# EAGLE design EspRelay (EAGLE 8.6.0)
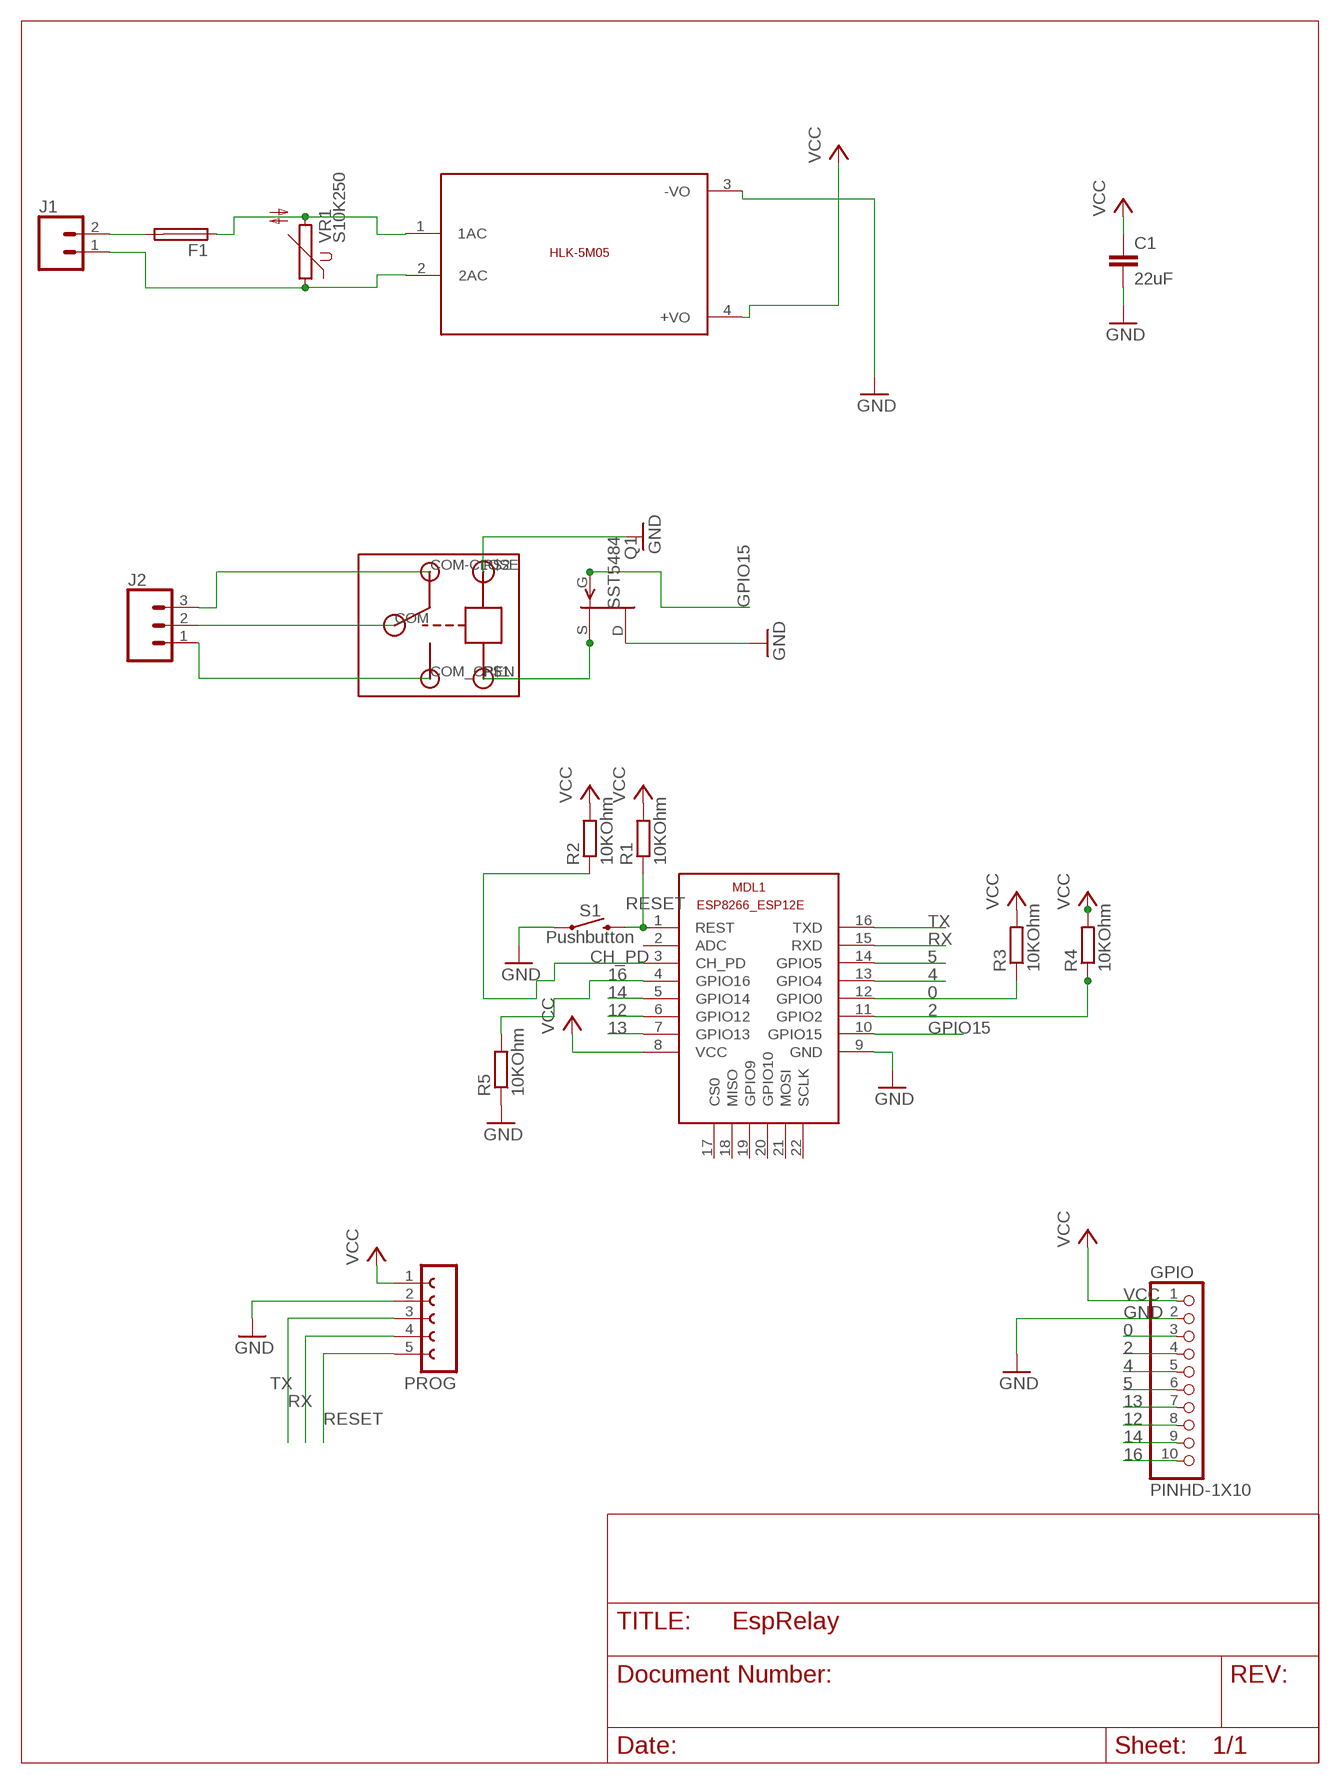
[diagram p0: schematic, sheet 1]

## Parts
C1  22uF  2.2UF-CERCAP-07888  [0402-CAP]
F1  PICOFUSE  [PICOFUSE]
GPIO  PINHD-1X10  [1X10-BIG]
J1  CONN_025MM  [SCREWTERMINAL-5MM-2]
J2  CONN_03-SCREW-5MM  [SCREWTERMINAL-5MM-3]
MDL1  ESP8266-12EESP8266-ESP12E  [ESP8266-ESP12E]
PROG  FE05-1  [FE05-1]
Q1  SST5484  [SOT23]
R1  10KOhm  R-EU_R0805  [R0805]
R2  10KOhm  R-EU_R0805  [R0805]
R3  10KOhm  R-EU_R0805  [R0805]
R4  10KOhm  R-EU_R0805  [R0805]
R5  10KOhm  R-EU_R0805  [R0805]
S1  Pushbutton  MOMENTARY-SWITCH-SPST-SMD-6.0X3.5MM  [TACTILE_SWITCH_SMD_6.0X3.5MM]
U$1  RELAY  [RELAY]
U$2  5VDC/5W  HLK-5M05  [HLK-5M05]
VR1  S10K250  [S10K250]

## Nets
0: GPIO.3 MDL1.12(GPIO0) R3.1
2: GPIO.4 MDL1.11(GPIO2) R4.1
4: GPIO.5 MDL1.13(GPIO4)
5: GPIO.6 MDL1.14(GPIO5)
12: GPIO.8 MDL1.6(GPIO12)
13: GPIO.7 MDL1.7(GPIO13)
14: GPIO.9 MDL1.5(GPIO14)
16: GPIO.10 MDL1.4(GPIO16) R5.2
CH_PD: MDL1.3(CH_PD) R2.1
GND: C1.2 GPIO.2 MDL1.9(GND) PROG.2 Q1.1(D) R5.1 S1.1 U$1.P$2(GND) U$2.3(-VO)
GPIO15: MDL1.10(GPIO15) Q1.3(G)
N$1: Q1.2(S) U$1.P$1(IN)
N$2: J2.1 U$1.COM_CPEN(COM-OPEN)
N$3: J2.2 U$1.COM
N$5: J2.3 U$1.COM-CLOSE
N$6: F1.2 J1.2
N$7: J1.1 U$2.2(2AC) VR1.1
N$8: F1.1 U$2.1(1AC) VR1.2
RESET: MDL1.1(REST) PROG.5 R1.1 S1.2
RX: MDL1.15(RXD) PROG.4
TX: MDL1.16(TXD) PROG.3
VCC: C1.1 GPIO.1 MDL1.8(VCC) PROG.1 R1.2 R2.2 R3.2 R4.2 U$2.4(+VO)
Unconnected: MDL1.2(ADC) MDL1.17(CS0) MDL1.18(MISO) MDL1.19(GPIO9) MDL1.20(GPIO10) MDL1.21(MOSI) MDL1.22(SCLK)

## Library data of the parts
C1 = SparkFun-Retired:2.2UF-CER: 2.2uF Ceramic SMT CAP-07888- 10V, 20% (0603) CAP-10009- 50V, 10% (1206); PROD_ID: CAP-07888; VALUE: 2.2uF
F1 = fuse:PICOFUSE: PICOFUSE 19275, Wickmann; OC_FARNELL: unknown; OC_NEWARK: unknown
GPIO = adafruit:PINHD-1X10: Pin header 1x10 0.1" spacing With round pins
J1 = SparkFun-Connectors:CONN_02: Multi connection point. Often used as Generic Header-pin footprint for 0.1 inch spaced/style header connections On any of the 0.1 inch spaced packages, you can populate with these: Break Away Headers - Straight <https://www.sparkfun.com/products/116> (PRT-00116) Break Away Male Headers - Right Angle <https://www.sparkfun.com/products/553> (PRT-00553) Female Headers <https://www.sparkfun.com/products/115> (PRT-00115) Break Away Headers - Machine Pin <https://www.sparkfun.com/products/117> (PRT-00117) Break Away Female Headers - Swiss Machine Pin <https://www.sparkfun.com/products/743> (PRT-00743) For SCREWTERMINALS and SPRING TERMINALS visit here: Screw Terimnals on SparkFun.com <https://www.sparkfun.com/search/results?term=Screw+Terminals> (5mm/3.5mm/2.54mm spacing) This device is also useful as a general connection point to wire up your design to another part of your project. Our various solder wires solder well into these plated through hole pads. Hook-Up Wire - Assortment (Stranded, 22 AWG) <https://www.sparkfun.com/products/11375> (PRT-11375) Hook-Up Wire - Assortment (Solid Core, 22 AWG) <https://www.sparkfun.com/products/11367> (PRT-11367) View the entire wire category on our website here <https://www.sparkfun.com/categories/141> Special notes: Molex polarized connector foot print use with: PRT-08233 with associated crimp pins and housings. 2.54_SCREWTERM for use with PRT-10571. 3.5mm Screw Terminal footprints for PRT-08084 5mm Screw Terminal footprints for use with PRT-08432; SF_SKU: PRT-08432
J2 = SparkFun-Connectors:CONN_03: Multi connection point. Often used as Generic Header-pin footprint for 0.1 inch spaced/style header connections On any of the 0.1 inch spaced packages, you can populate with these: Break Away Headers - Straight <https://www.sparkfun.com/products/116> (PRT-00116) Break Away Male Headers - Right Angle <https://www.sparkfun.com/products/553> (PRT-00553) Female Headers <https://www.sparkfun.com/products/115> (PRT-00115) Break Away Headers - Machine Pin <https://www.sparkfun.com/products/117> (PRT-00117) Break Away Female Headers - Swiss Machine Pin <https://www.sparkfun.com/products/743> (PRT-00743) Stackable Header - 3 Pin (Female, 0.1") <https://www.sparkfun.com/products/13875> (PRT-13875) For SCREWTERMINALS and SPRING TERMINALS visit here: Screw Terimnals on SparkFun.com <https://www.sparkfun.com/search/results?term=Screw+Terminals> (5mm/3.5mm/2.54mm spacing) This device is also useful as a general connection point to wire up your design to another part of your project. Our various solder wires solder well into these plated through hole pads. Hook-Up Wire - Assortment (Stranded, 22 AWG) <https://www.sparkfun.com/products/11375> (PRT-11375) Hook-Up Wire - Assortment (Solid Core, 22 AWG) <https://www.sparkfun.com/products/11367> (PRT-11367) View the entire wire category on our website here <https://www.sparkfun.com/categories/141> Special notes: Molex polarized connector foot print use with SKU : PRT-08232 with associated crimp pins and housings.; PROD_ID: CONN-10134; SF_SKU: PRT-08433
MDL1 = ESP8266-ESP12E:ESP8266-12E: ESP8266-12E with additional I/O and GPIO04/05 corrected The author cannot warrant that this library is free from error or will meet your specific requirements. Created by PuceBaboon.com. Komagane, Nagano, JAPAN
PROG = con-lsta:FE05-1: FEMALE HEADER; OC_FARNELL: unknown; OC_NEWARK: unknown
Q1 = transistor-fet:?548*: N-Channel JFETs Source: VISHAY 2N5484.pdf Compatible: TO92 2N5245 J304 J305 U310 J308 J309 J310 TO72 2N4416 2N4416A 2N3823 2N4351 3N169 3N170 3N171 MFE3002 TO18 2N3796 2N3797 MFE825 Source: Motorola European Master Guide Pacge 3-59
R1-R5 = rcl:R-EU_: RESISTOR, European symbol; SPICEPREFIX: R
S1 = SparkFun-Switches:MOMENTARY-SWITCH-SPST: Momentary Switch (Pushbutton) - SPST Normally-open (NO) SPST momentary switches (buttons, pushbuttons). Variants PTH-12MM - 12mm square, through-hole Momentary Pushbutton Switch - 12mm Square <https://www.sparkfun.com/products/9190> (COM-09190) PTH-6.0MM, PTH-6.0MM-KIT - 6.0mm square, through-hole Mini Pushbutton Switch <https://www.sparkfun.com/products/97> (COM-00097) KIT package intended for soldering kit's - only one side of pads' copper is exposed. PTH-RIGHT-ANGLE-KIT - Right-angle, through-hole Right Angle Tactile Button <https://www.sparkfun.com/products/10791> - Used on SparkFun BigTime Watch Kit <https://www.sparkfun.com/products/11734> SMD-12MM - 12mm square, surface-mount Tactile Button - SMD (12mm) <https://www.sparkfun.com/products/12993> (COM-12993) Used on SparkFun PicoBoard <https://www.sparkfun.com/products/11888> SMD-4.5MM - 4.5mm Square Trackball Switch Used on SparkFun Blackberry Trackballer Breakout <https://www.sparkfun.com/products/13169> SMD-4.6MMX2.8MM - 4.60mm x 2.80mm, surface mount Used on SparkFun SAMD21 Mini Breakout <https://www.sparkfun.com/products/13664> SMD-5.2MM, SMD-5.2-REDUNDANT - 5.2mm square, surface-mount Mini Pushbutton Switch - SMD <https://www.sparkfun.com/products/8720> (COM-08720) Used on Arduino Pro Mini <https://www.sparkfun.com/products/11114> REDUNDANT package connects both switch circuits together SMD-6.0X3.5MM - 6.0 x 3.5mm, surface mount Momentary Reset Switch SMD <https://www.sparkfun.com/products/8229> (COM-08229) SMD-6.2MM-TALL - 6.2mm square, surface mount Tactile Button - SMD (6mm) <https://www.sparkfun.com/products/12992> Used on SparkFun Digital Sandbox <https://www.sparkfun.com/products/12651> SMD-RIGHT-ANGLE - Right-angle, surface mount Used on SparkFun Block for Intel® Edison - Arduino <https://www.sparkfun.com/products/13036>; PROD_ID: SWCH-00815; SF_SKU: COM-08229
U$1 = RELAY:RELAY
U$2 = HLK-5M05:HLK-5M05: HLK-5M05 is an 5Volt/5W smps developed by HI-LINK; SIZE: 23x38(mm)
VR1 = varistor:S10K250: VARISTOR

## Board
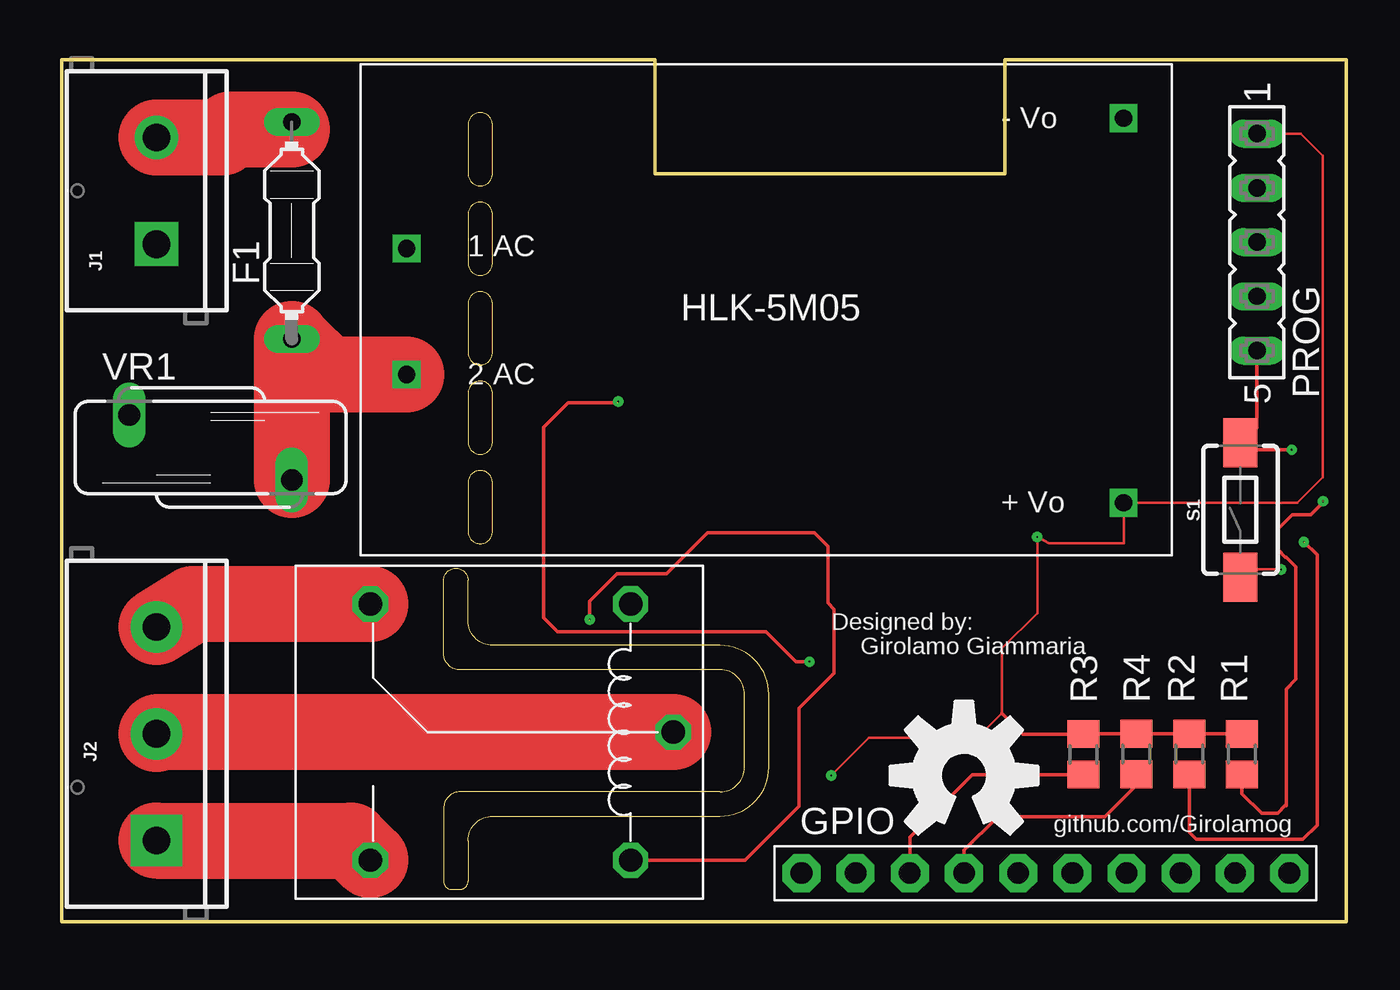
[diagram p1: board, top side]
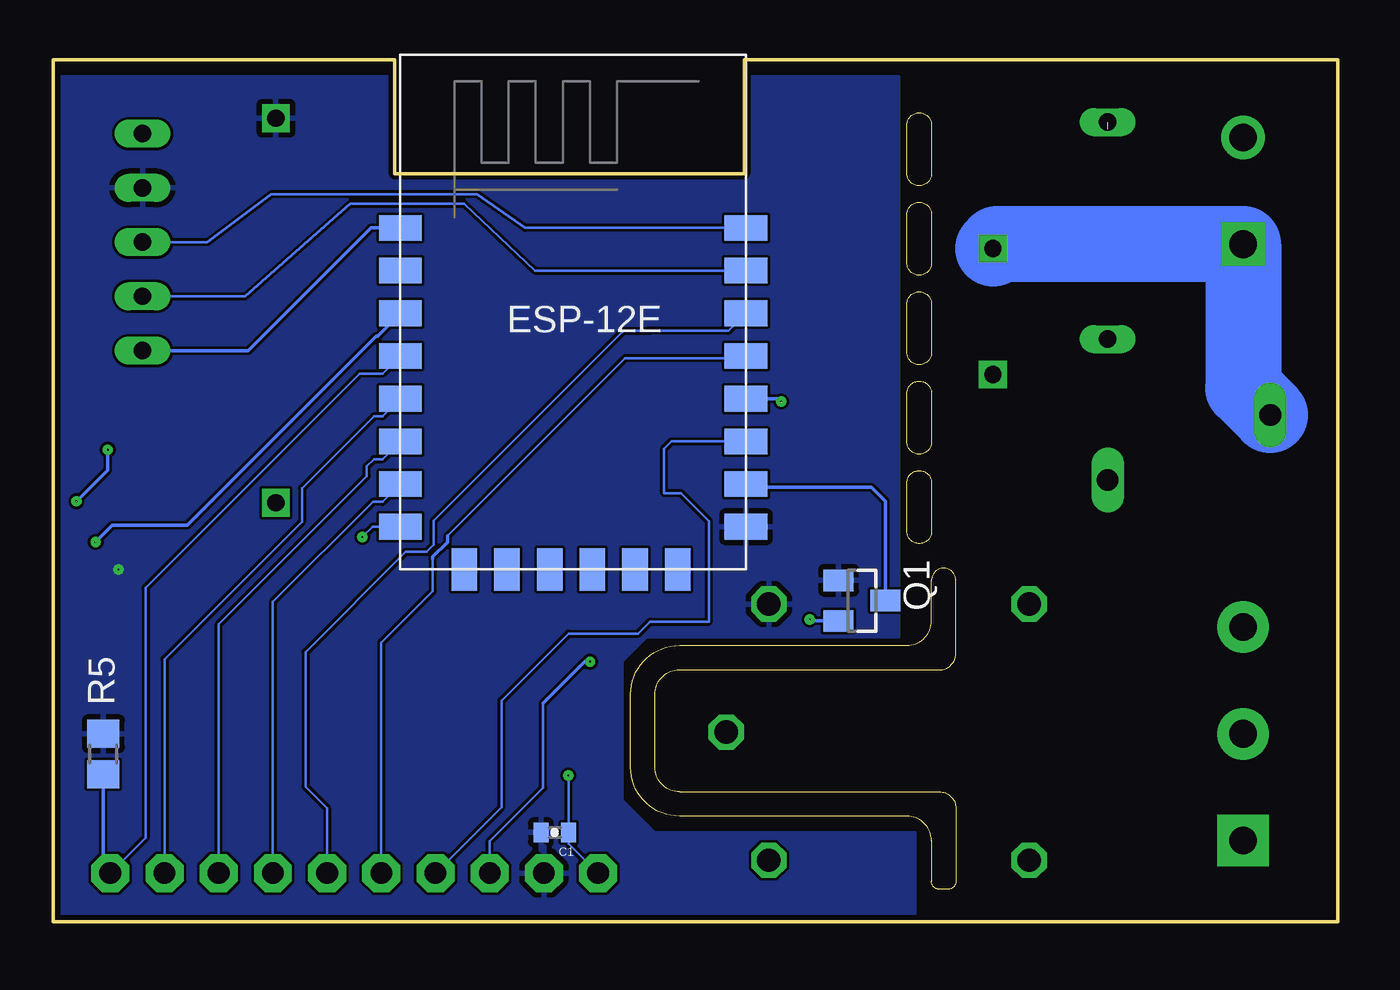
[diagram p2: board, bottom side, seen from below]

Size 60.2 x 40.39 mm. Coordinates in mm from the lower left corner, seen from the top.
Outline: 19.05,3.81 arc-90 20.19,4.95 30.86,4.95 arc90 33.15,7.24 33.15,10.67 arc90 30.86,12.95 20.19,12.95 arc-90 19.05,14.1 19.05,16 arc180 17.91,16 17.91,12.57 arc90 18.67,11.81 30.86,11.81 arc-90 32,10.67 32,7.24 arc-90 30.86,6.1 18.67,6.1 arc90 17.91,5.33 17.91,1.91 arc90 18.29,1.52 18.67,1.52 arc90 19.05,1.91 19.05,3.81
Outline: 19.05,20.57 19.05,18.29 arc180 20.19,18.29 20.19,20.57 arc180 19.05,20.57
Outline: 19.05,24.77 19.05,22.48 arc180 20.19,22.48 20.19,24.77 arc180 19.05,24.77
Outline: 19.05,28.96 19.05,26.67 arc180 20.19,26.67 20.19,28.96 arc180 19.05,28.96
Outline: 19.05,33.15 19.05,30.86 arc180 20.19,30.86 20.19,33.15 arc180 19.05,33.15
Outline: 19.05,37.34 19.05,35.05 arc180 20.19,35.05 20.19,37.34 arc180 19.05,37.34
Outline: 27.81,35.05 44.2,35.05 44.2,40.39 60.2,40.39 60.2,0 0,0 0,40.39 27.81,40.39 27.81,35.05
Copper layers (1*16): Top 0.035mm / dielectric 1.5mm / Bottom 0.035mm
Design rules "default *": minimum track width 3.5mil, minimum drill 0.2mm, track to track 5mil, track to pad 10mil, pad to pad 10mil, via to via 10mil, smd to smd 6mil, copper to edge 0.2mm, drill to drill 6mil, minimum pad ring 10mil, minimum via ring 8mil, stop-mask expansion 4mil, vias tented up to drill 0mil, thermal gap 10mil

### Footprints (pad centres in the part's own frame; a part is rotated, then mirrored left to right if it is on the bottom)
0402-CAP = smd 0.7 x 0.9: 1 -0.65,0; 2 0.65,0
PICOFUSE = drill 0.813 long: 1 -5.08,0; 2 5.08,0
1X10-BIG = drill 1.016 pad 1.778 octagon: 1 -11.43,0; 2 -8.89,0; 3 -6.35,0; 4 -3.81,0; 5 -1.27,0; 6 1.27,0; 7 3.81,0; 8 6.35,0; 9 8.89,0; 10 11.43,0
SCREWTERMINAL-5MM-2 = drill 1.3 pad 2.032 square: 1 0,0 | drill 1.3 pad 2.032: 2 5,0
SCREWTERMINAL-5MM-3 = drill 1.3 pad 2.413 square: 1 0,0 | drill 1.3 pad 2.413: 2 5,0; 3 10,0
ESP8266-ESP12E = smd 2 x 1.2: 1 0,16; 2 0,14; 3 0,12; 4 0,10; 5 0,8; 6 0,6; 7 0,4; 8 0,2; 9 16.2,2; 10 16.2,4; 11 16.2,6; 12 16.2,8; 13 16.2,10; 14 16.2,12; 15 16.2,14; 16 16.2,16 | smd 1.2 x 2: 17 11,0; 18 3,0; 19 5,0; 20 13,0; 21 7,0; 22 9,0
FE05-1 = drill 0.813 long: 1 -5.08,0; 2 -2.54,0; 3 0,0; 4 2.54,0; 5 5.08,0
SOT23 = smd 1 x 1.4: 1 -0.95,-1.1; 2 0.95,-1.1; 3 0,1.1
R0805 = smd 1.3 x 1.5: 1 -0.95,0; 2 0.95,0
TACTILE_SWITCH_SMD_6.0X3.5MM = smd 2.3 x 1.6: 1 -3.15,0; 2 3.15,0
RELAY = drill 1.1 octagon: COM -2,0; COM-CLOSE 12.2,-6; COM_CPEN 12.2,6; P$1 0,6; P$2 0,-6
HLK-5M05 = drill 0.8 square: 1 -16.85,-2.93; 2 -16.85,2.97; 3 16.75,9.07; 4 16.75,-8.93
S10K250 = drill 1.016 long: 1 -1.524,-3.81; 2 1.524,3.81

### Placement (x,y rotation side)
C1  36.7,4.19 180 bottom
F1  10.79,32.38 90 top
GPIO  46.1,2.29 0 top
J1  4.45,31.75 90 top
J2  4.45,3.81 90 top
MDL1  43.94,16.51 0 bottom
PROG  56.02,31.85 270 top
Q1  22.3,15.05 270 bottom
R1  55.32,7.86 90 top
R2  52.84,7.86 90 top
R3  47.89,7.85 90 top
R4  50.37,7.87 90 top
R5  57.86,7.87 270 bottom
S1  55.24,19.3 90 top
U$1  26.67,8.89 180 top
U$2  33.02,28.57 0 top
U$3  [OSHW-LOGO-L]  42.29,6.86 0 top
VR1  6.99,22.23 270 top

### Tracks (layer width: path | path; a pad name or v marks a point on that pad's centre or on a via)
0  (via drill 0.08)  (1 unrouted)
  Top 0.152: R3.1 42.69,6.9 39.75,3.97 GPIO.3 | 26.13,24.4 26.07,24.33 23.74,24.33 22.58,23.17 22.58,14.25 23.24,13.59 33.02,13.59 34.42,12.19 v35.05,12.19
  Bottom 0.127: GPIO.3 39.75,3.77 37.25,6.28 37.25,10.26
  Bottom 0.152: MDL1.12 26.25,24.51 26.09,24.35 | 37.25,10.26 35.31,12.19 v35.05,12.19
2
  Top 0.152: R4.1 50.37,6.4 48.9,4.93 43.87,4.93 42.29,3.35 GPIO.4
  Bottom 0.127: GPIO.4 39.2,5.38 39.2,10.37 36.06,13.5 32.8,13.5 32.23,14.07 29.49,14.07 29.49,18.77 30.79,20.08 31.58,20.08 31.58,22.17 31.24,22.51 MDL1.11
4
  Bottom 0.127: MDL1.13 27.84,26.42 33.4,26.42 41.74,18.08 | 42.42,17.02 42.42,15.49 44.83,13.08 GPIO.5
  Bottom 0.152: 41.74,18.08 41.74,17.78 42.42,17.1 42.42,17.02
5
  Bottom 0.127: MDL1.14 28.57,27.68 32.26,27.68 32.36,27.68 33.48,27.68 42.37,18.8 42.37,17.67 42.7,17.34 43.69,17.34 48.39,12.64 48.39,6.34 47.37,5.33 GPIO.6
12
  Bottom 0.127: GPIO.8 52.45,13.95 45.51,20.89 45.51,21.35 45.18,21.68 44.77,21.68 MDL1.6
13
  Bottom 0.127: MDL1.7 44.77,19.68 45.22,19.68 49.91,14.99 GPIO.7
14
  Bottom 0.127: MDL1.5 44.77,23.68 45.18,23.68 48.54,20.32 48.54,18.75 54.99,12.31 GPIO.9
16
  Bottom 0.127: MDL1.4 44.77,25.68 45.85,25.68 55.88,15.65 55.88,3.94 GPIO.10
  Bottom 0.152: R5.2 57.86,2.61 GPIO.10
CH_PD  (1 unrouted)
  Top 0.152: R2.1 52.84,4.2 53.17,3.87 58.17,3.87 58.84,4.53 58.84,17.2 58.22,17.82
  Bottom 0.152: MDL1.3 45.01,27.44 45.08,27.44 53.93,18.59 57.43,18.59 58.24,17.78
GND  (via drill 0.08 pad 0.13)
  Top 0.127: S1.1 55.6,16.51 v57.15,16.51
  pour Bottom: 19.81,0.38 59.82,0.38 59.82,39.62 20.57,39.62 20.57,13.34 32.38,13.34 33.53,12.19 33.53,5.71 32.38,4.57 32,4.19 19.81,4.19
GND1  (via drill 0.08 pad 0.13)
  other vias: 58.22,17.8
GPIO15
  Bottom 0.152: Q1.3 21.2,19.7 21.86,20.36 27.6,20.36 MDL1.10
N$1  (1 unrouted)
  Top 0.152: U$1.P$1 32.04,2.89 34.56,5.42 34.56,10.01 36.2,11.64 36.2,14.65 35.91,14.94 35.91,17.61 35.29,18.22 30.28,18.22 28.36,16.3 26.04,16.3 24.75,15.01 24.75,14.12
  Bottom 0.152: Q1.2 24.7,14.1 24.76,14.16
N$2
  Top 3.556: J2.1 13.55,3.81 U$1.COM_CPEN
N$3
  Top 3.556: U$1.COM 4.53,8.89 J2.2
N$4  (via drill 0.08)
  other vias: 26.09,24.38
N$5
  Top 3.556: U$1.COM-CLOSE 6.16,14.89 J2.3
N$6  (1 unrouted)
  Top 3.556: J1.2 7.54,36.75 7.92,37.13 10.79,37.13
N$7
  Bottom 3.556: U$2.2 15.96,31.75 J1.1 4.45,25.02 VR1.1
N$8
  Top 3.556: U$2.1 12.46,25.64 F1.1 VR1.2
N$9
  Bottom 0.152: 59.14,19.7 59.14,19.68
N$11  (via drill 0.08 pad 0.41)
  other vias: 24.75,14.17
RESET  (via drill 0.08)  (1 unrouted)
  Top 0.152: R1.1 55.32,6.02 56.24,5.09 56.98,5.09 57.33,5.43 57.38,5.43 57.38,10.91 57.83,11.36 57.83,16.63 57.39,17.08 57.35,17.08 57.01,17.43 57.01,18.42 57.66,19.08 58.55,19.08 59.13,19.66 59.13,19.7 | 54.49,22.45 S1.2 55.28,22.42 | v57.65,22.12 55.58,22.12 55.28,22.42 | PROG.5 56.02,23.15 55.28,22.42
  Bottom 0.152: MDL1.1 45.32,32.51 51.06,26.77 PROG.5 | v59.11,19.7 57.65,21.17 v57.65,22.12 57.65,22.17
RX
  Bottom 0.127: PROG.4 51.21,29.31 46.28,33.64 40.95,33.64 37.62,30.51 MDL1.15
TX
  Bottom 0.127: MDL1.16 38.1,32.51 40.35,34.08 50,34.08 52.99,31.85 PROG.3
VCC  (via drill 0.08 pad 0.13)
  Top 0.127: v36.07,6.86 37.85,8.64 42.93,8.64 44.07,9.78 44.07,12.81 45.72,14.46 v45.72,18.03 46.27,17.74 49.77,17.74 U$2.4 57.91,19.64 59.1,20.83 59.1,35.9 58.07,36.93 PROG.1
  Top 0.152: R1.2 R2.2 R4.2 47.9,8.82 R3.2 45.05,8.8 44.07,9.78
  Bottom 0.127: GPIO.1 36.05,3.67 C1.1 36.05,6.03 36.07,6.04 v36.07,6.86 | MDL1.8 45.24,18.51 v45.72,18.03

### Text on the board
tPlace: Designed by: | Girolamo Giammaria | github.com/Girolamog